# Altium schematic sheet Keyboard Matrix.SchDoc
size B; SheetNumber: 4; SheetTotal: 9
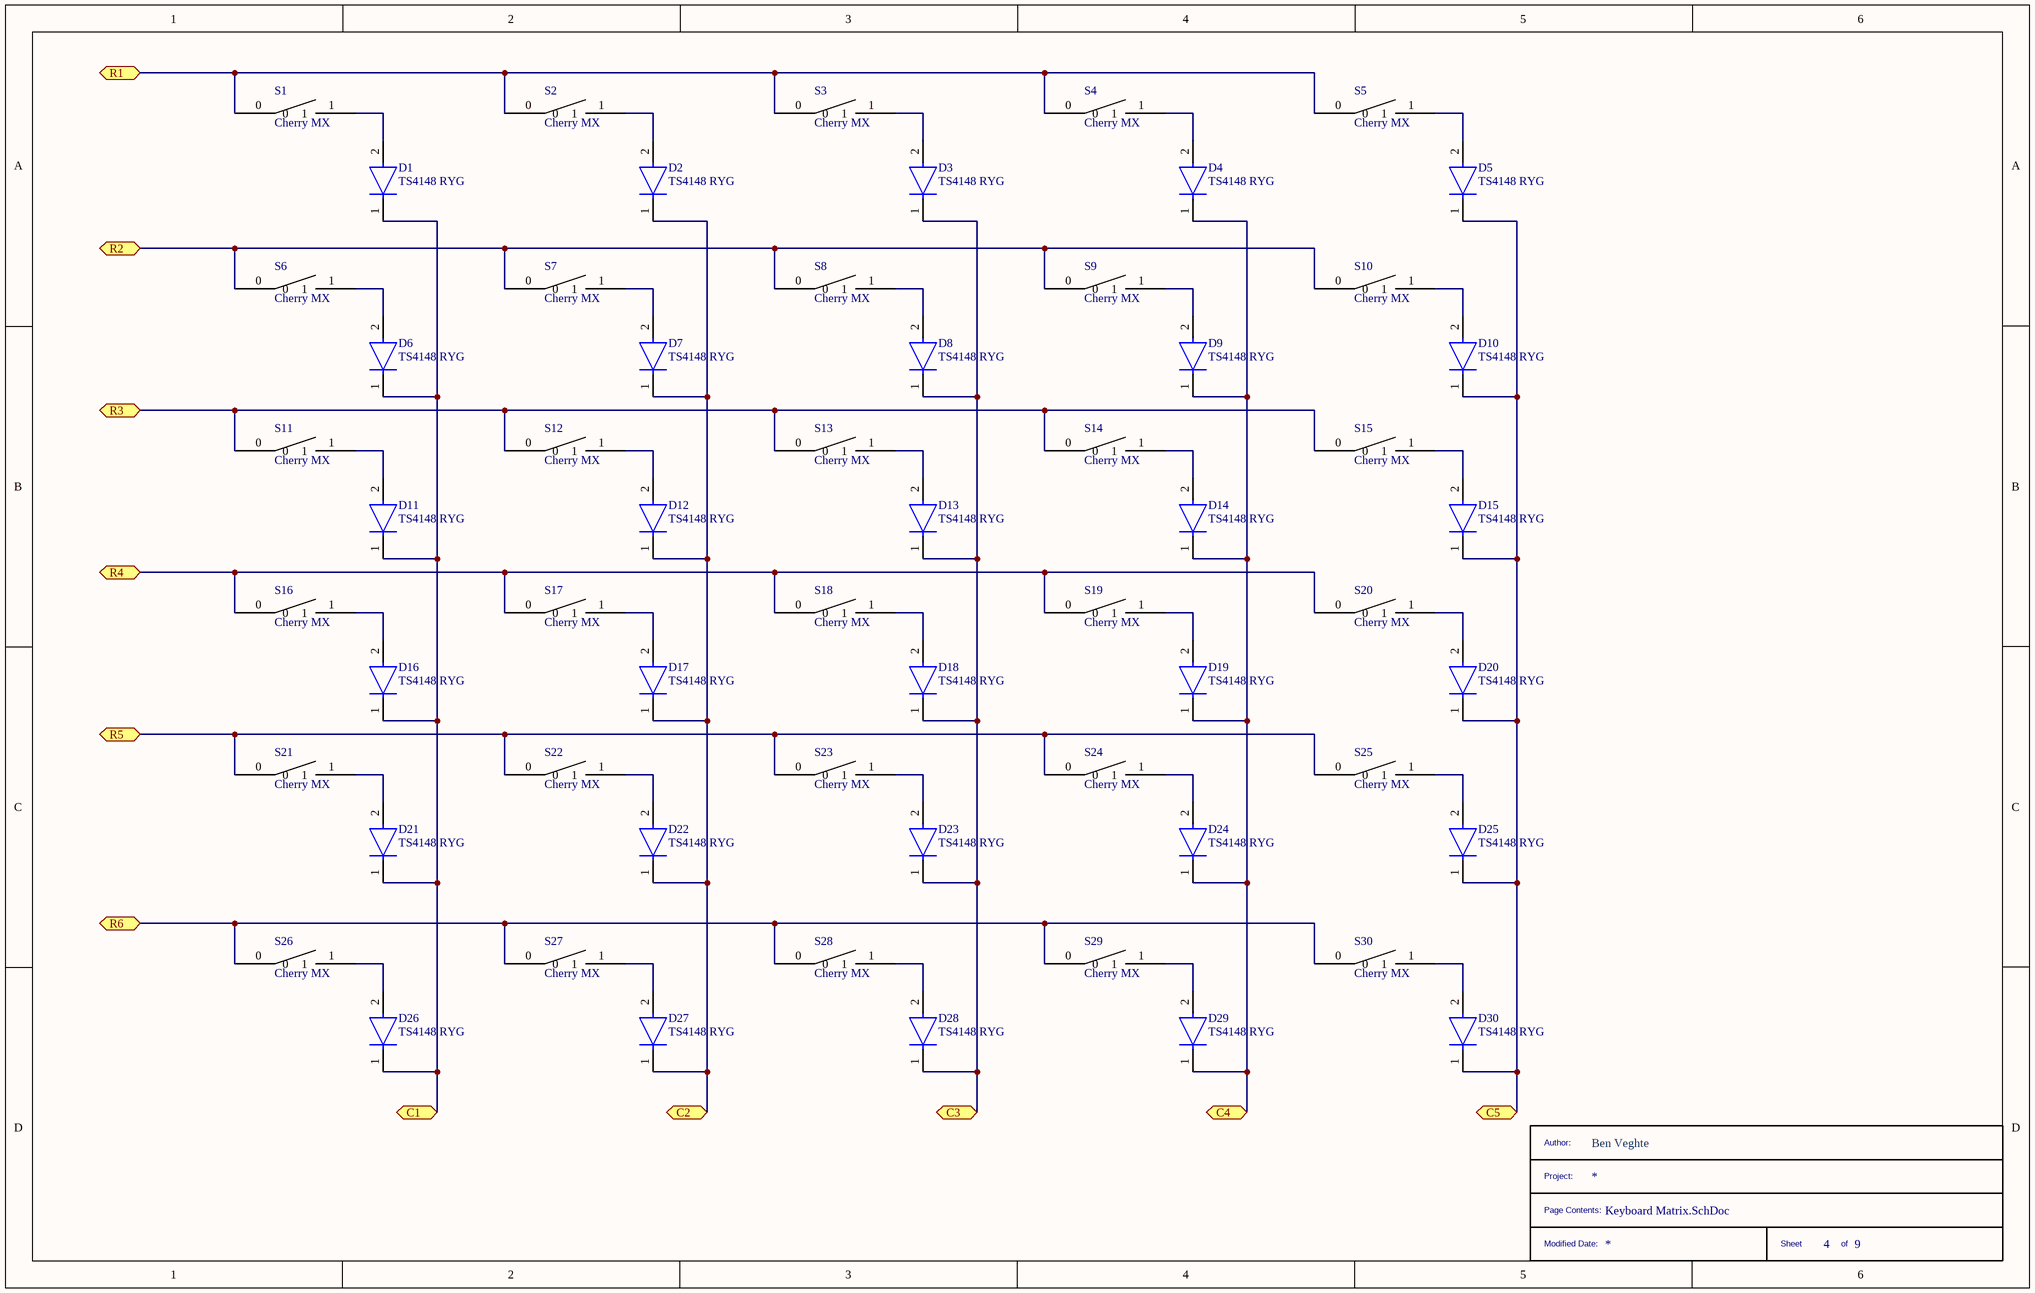
[diagram p0: Keyboard Matrix.SchDoc]

## Parts
*  __TITLE_BLOCK__  (value not drawn)  (graphical)
D1  TS4148 RYG  [FP-TS4148_RYG-MFG]
D2  TS4148 RYG  [FP-TS4148_RYG-MFG]
D3  TS4148 RYG  [FP-TS4148_RYG-MFG]
D4  TS4148 RYG  [FP-TS4148_RYG-MFG]
D5  TS4148 RYG  [FP-TS4148_RYG-MFG]
D6  TS4148 RYG  [FP-TS4148_RYG-MFG]
D7  TS4148 RYG  [FP-TS4148_RYG-MFG]
D8  TS4148 RYG  [FP-TS4148_RYG-MFG]
D9  TS4148 RYG  [FP-TS4148_RYG-MFG]
D10  TS4148 RYG  [FP-TS4148_RYG-MFG]
D11  TS4148 RYG  [FP-TS4148_RYG-MFG]
D12  TS4148 RYG  [FP-TS4148_RYG-MFG]
D13  TS4148 RYG  [FP-TS4148_RYG-MFG]
D14  TS4148 RYG  [FP-TS4148_RYG-MFG]
D15  TS4148 RYG  [FP-TS4148_RYG-MFG]
D16  TS4148 RYG  [FP-TS4148_RYG-MFG]
D17  TS4148 RYG  [FP-TS4148_RYG-MFG]
D18  TS4148 RYG  [FP-TS4148_RYG-MFG]
D19  TS4148 RYG  [FP-TS4148_RYG-MFG]
D20  TS4148 RYG  [FP-TS4148_RYG-MFG]
D21  TS4148 RYG  [FP-TS4148_RYG-MFG]
D22  TS4148 RYG  [FP-TS4148_RYG-MFG]
D23  TS4148 RYG  [FP-TS4148_RYG-MFG]
D24  TS4148 RYG  [FP-TS4148_RYG-MFG]
D25  TS4148 RYG  [FP-TS4148_RYG-MFG]
D26  TS4148 RYG  [FP-TS4148_RYG-MFG]
D27  TS4148 RYG  [FP-TS4148_RYG-MFG]
D28  TS4148 RYG  [FP-TS4148_RYG-MFG]
D29  TS4148 RYG  [FP-TS4148_RYG-MFG]
D30  TS4148 RYG  [FP-TS4148_RYG-MFG]
S1  Cherry MX  [Cherry MX]
S2  Cherry MX  [Cherry MX]
S3  Cherry MX  [Cherry MX]
S4  Cherry MX  [Cherry MX]
S5  Cherry MX  [Cherry MX]
S6  Cherry MX  [Cherry MX]
S7  Cherry MX  [Cherry MX]
S8  Cherry MX  [Cherry MX]
S9  Cherry MX  [Cherry MX]
S10  Cherry MX  [Cherry MX]
S11  Cherry MX  [Cherry MX]
S12  Cherry MX  [Cherry MX]
S13  Cherry MX  [Cherry MX]
S14  Cherry MX  [Cherry MX]
S15  Cherry MX  [Cherry MX]
S16  Cherry MX  [Cherry MX]
S17  Cherry MX  [Cherry MX]
S18  Cherry MX  [Cherry MX]
S19  Cherry MX  [Cherry MX]
S20  Cherry MX  [Cherry MX]
S21  Cherry MX  [Cherry MX]
S22  Cherry MX  [Cherry MX]
S23  Cherry MX  [Cherry MX]
S24  Cherry MX  [Cherry MX]
S25  Cherry MX  [Cherry MX]
S26  Cherry MX  [Cherry MX]
S27  Cherry MX  [Cherry MX]
S28  Cherry MX  [Cherry MX]
S29  Cherry MX  [Cherry MX]
S30  Cherry MX  [Cherry MX]

## Ports
C1 (bidir), C2 (bidir), C3 (bidir), C4 (bidir), C5 (bidir), R1 (bidir), R2 (bidir), R3 (bidir), R4 (bidir), R5 (bidir), R6 (bidir)

## Nets
C1: D1.1(C) D6.1(C) D11.1(C) D16.1(C) D21.1(C) D26.1(C) ; port C1
C2: D2.1(C) D7.1(C) D12.1(C) D17.1(C) D22.1(C) D27.1(C) ; port C2
C3: D3.1(C) D8.1(C) D13.1(C) D18.1(C) D23.1(C) D28.1(C) ; port C3
C4: D4.1(C) D9.1(C) D14.1(C) D19.1(C) D24.1(C) D29.1(C) ; port C4
C5: D5.1(C) D10.1(C) D15.1(C) D20.1(C) D25.1(C) D30.1(C) ; port C5
R1: S1.0 S2.0 S3.0 S4.0 S5.0 ; port R1
R2: S6.0 S7.0 S8.0 S9.0 S10.0 ; port R2
R3: S11.0 S12.0 S13.0 S14.0 S15.0 ; port R3
R4: S16.0 S17.0 S18.0 S19.0 S20.0 ; port R4
R5: S21.0 S22.0 S23.0 S24.0 S25.0 ; port R5
R6: S26.0 S27.0 S28.0 S29.0 S30.0 ; port R6
NetD1_2: D1.2(A) S1.1
NetD2_2: D2.2(A) S2.1
NetD3_2: D3.2(A) S3.1
NetD4_2: D4.2(A) S4.1
NetD5_2: D5.2(A) S5.1
NetD6_2: D6.2(A) S6.1
NetD7_2: D7.2(A) S7.1
NetD8_2: D8.2(A) S8.1
NetD9_2: D9.2(A) S9.1
NetD10_2: D10.2(A) S10.1
NetD11_2: D11.2(A) S11.1
NetD12_2: D12.2(A) S12.1
NetD13_2: D13.2(A) S13.1
NetD14_2: D14.2(A) S14.1
NetD15_2: D15.2(A) S15.1
NetD16_2: D16.2(A) S16.1
NetD17_2: D17.2(A) S17.1
NetD18_2: D18.2(A) S18.1
NetD19_2: D19.2(A) S19.1
NetD20_2: D20.2(A) S20.1
NetD21_2: D21.2(A) S21.1
NetD22_2: D22.2(A) S22.1
NetD23_2: D23.2(A) S23.1
NetD24_2: D24.2(A) S24.1
NetD25_2: D25.2(A) S25.1
NetD26_2: D26.2(A) S26.1
NetD27_2: D27.2(A) S27.1
NetD28_2: D28.2(A) S28.1
NetD29_2: D29.2(A) S29.1
NetD30_2: D30.2(A) S30.1

## Notes on the sheet
- (in symbol __TITLE_BLOCK__) Author:; Ben Veghte; Project:; Page Contents:; Modified Date:; Sheet; of

## Library data of the parts
D1-D30 = CMP-15605-000006-1: Rectifier Diode Switching 75V 0.15A 4ns 2-Pin Case 0805(2012Metric) T/R; Peak Non-Repetitive Surge Current: 2A; Element Configuration: Single; Forward Voltage: 1V; Max Operating Temperature: 175°C; Packaging: Tape and Reel; Radiation Hardening: No; Min Operating Temperature: -65°C; Reverse Recovery Time: 4ns; Mount: Surface Mount; RoHS Compliant: Yes; Max Forward Surge Current (Ifsm): 2A; Case/Package: SMD/SMT; Number of Pins: 2; Max Repetitive Reverse Voltage (Vrrm): 75V
S1-S30 = Cherry MX: Cherry MX Brown With Fixation Pins